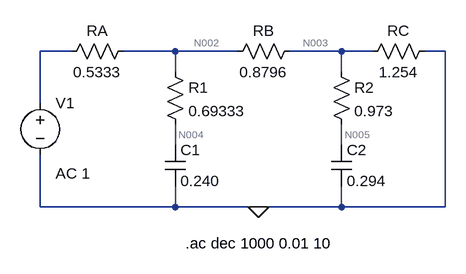
[diagram p0: schematic TS11.asc]
TS11.asc, the LTspice schematic file:
Version 4
SHEET 1 880 680
WIRE 16 96 -32 96
WIRE 176 96 96 96
WIRE 272 96 176 96
WIRE 432 96 352 96
WIRE 480 96 432 96
WIRE 592 96 560 96
WIRE 176 128 176 96
WIRE 432 128 432 96
WIRE -32 176 -32 96
WIRE 176 240 176 208
WIRE 432 240 432 208
WIRE -32 336 -32 256
WIRE 176 336 176 304
WIRE 176 336 -32 336
WIRE 304 336 176 336
WIRE 432 336 432 304
WIRE 432 336 304 336
WIRE 592 336 592 96
WIRE 592 336 432 336
FLAG 304 336 0
SYMBOL res 112 80 R90
WINDOW 0 0 56 VBottom 2
WINDOW 3 32 56 VTop 2
SYMATTR InstName RA
SYMATTR Value 0.5333
SYMBOL cap 160 240 R0
SYMATTR InstName C1
SYMATTR Value 0.240
SYMBOL res 368 80 R90
WINDOW 0 0 56 VBottom 2
WINDOW 3 32 56 VTop 2
SYMATTR InstName RB
SYMATTR Value 0.8796
SYMBOL res 160 112 R0
SYMATTR InstName R1
SYMATTR Value 0.69333
SYMBOL cap 416 240 R0
SYMATTR InstName C2
SYMATTR Value 0.294
SYMBOL res 416 112 R0
SYMATTR InstName R2
SYMATTR Value 0.973
SYMBOL res 576 80 R90
WINDOW 0 0 56 VBottom 2
WINDOW 3 32 56 VTop 2
SYMATTR InstName RC
SYMATTR Value 1.254
SYMBOL voltage -32 160 R0
WINDOW 123 24 124 Left 2
WINDOW 39 0 0 Left 0
SYMATTR InstName V1
SYMATTR Value ""
SYMATTR Value2 AC 1
TEXT 192 392 Left 2 !.ac dec 1000 0.01 10

The netlist it stands for:
* TS11.asc
RA N002 N001 0.5333
C1 N004 0 0.240
RB N003 N002 0.8796
R1 N002 N004 0.69333
C2 N005 0 0.294
R2 N003 N005 0.973
RC 0 N003 1.254
V1 N001 0 AC 1
.ac dec 1000 0.01 10
.backanno
.end

* Results of the author's LTspice run, read from the files saved beside the schematic
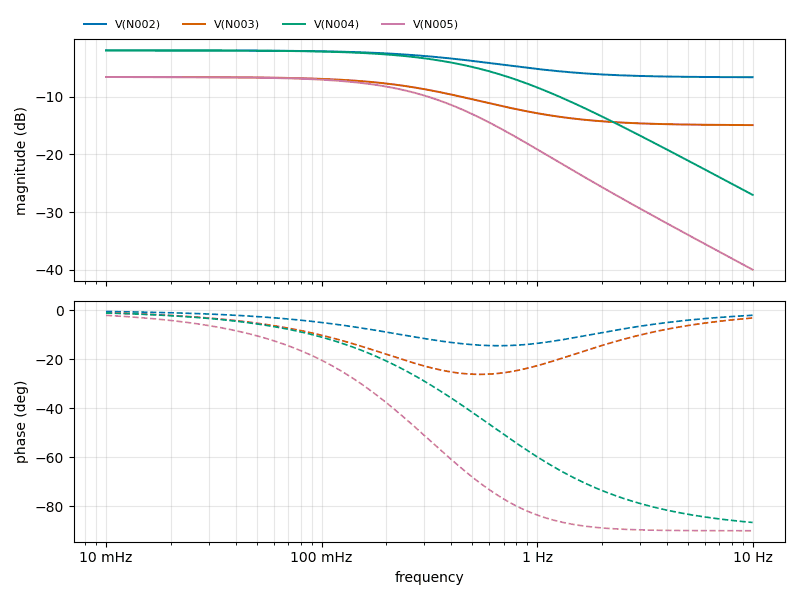
[diagram p1: AC Analysis of TS11.asc, plotted from the saved traces]
* AC Analysis, 1 run:
*   V(N002): -1.94 dB at 10 mHz, -6.60 dB at 10 Hz, peak -1.94 dB at 10 mHz, 3 dB below the peak at 896.2 mHz
*   V(N003): -6.56 dB at 10 mHz, -14.91 dB at 10 Hz, peak -6.56 dB at 10 mHz, 3 dB below the peak at 395.6 mHz
*   V(N004): -1.94 dB at 10 mHz, -27.02 dB at 10 Hz, peak -1.94 dB at 10 mHz, 3 dB below the peak at 518.2 mHz
*   V(N005): -6.56 dB at 10 mHz, -40.01 dB at 10 Hz, peak -6.56 dB at 10 mHz, 3 dB below the peak at 287 mHz